# Altium schematic sheet MCU.SchDoc
size A3
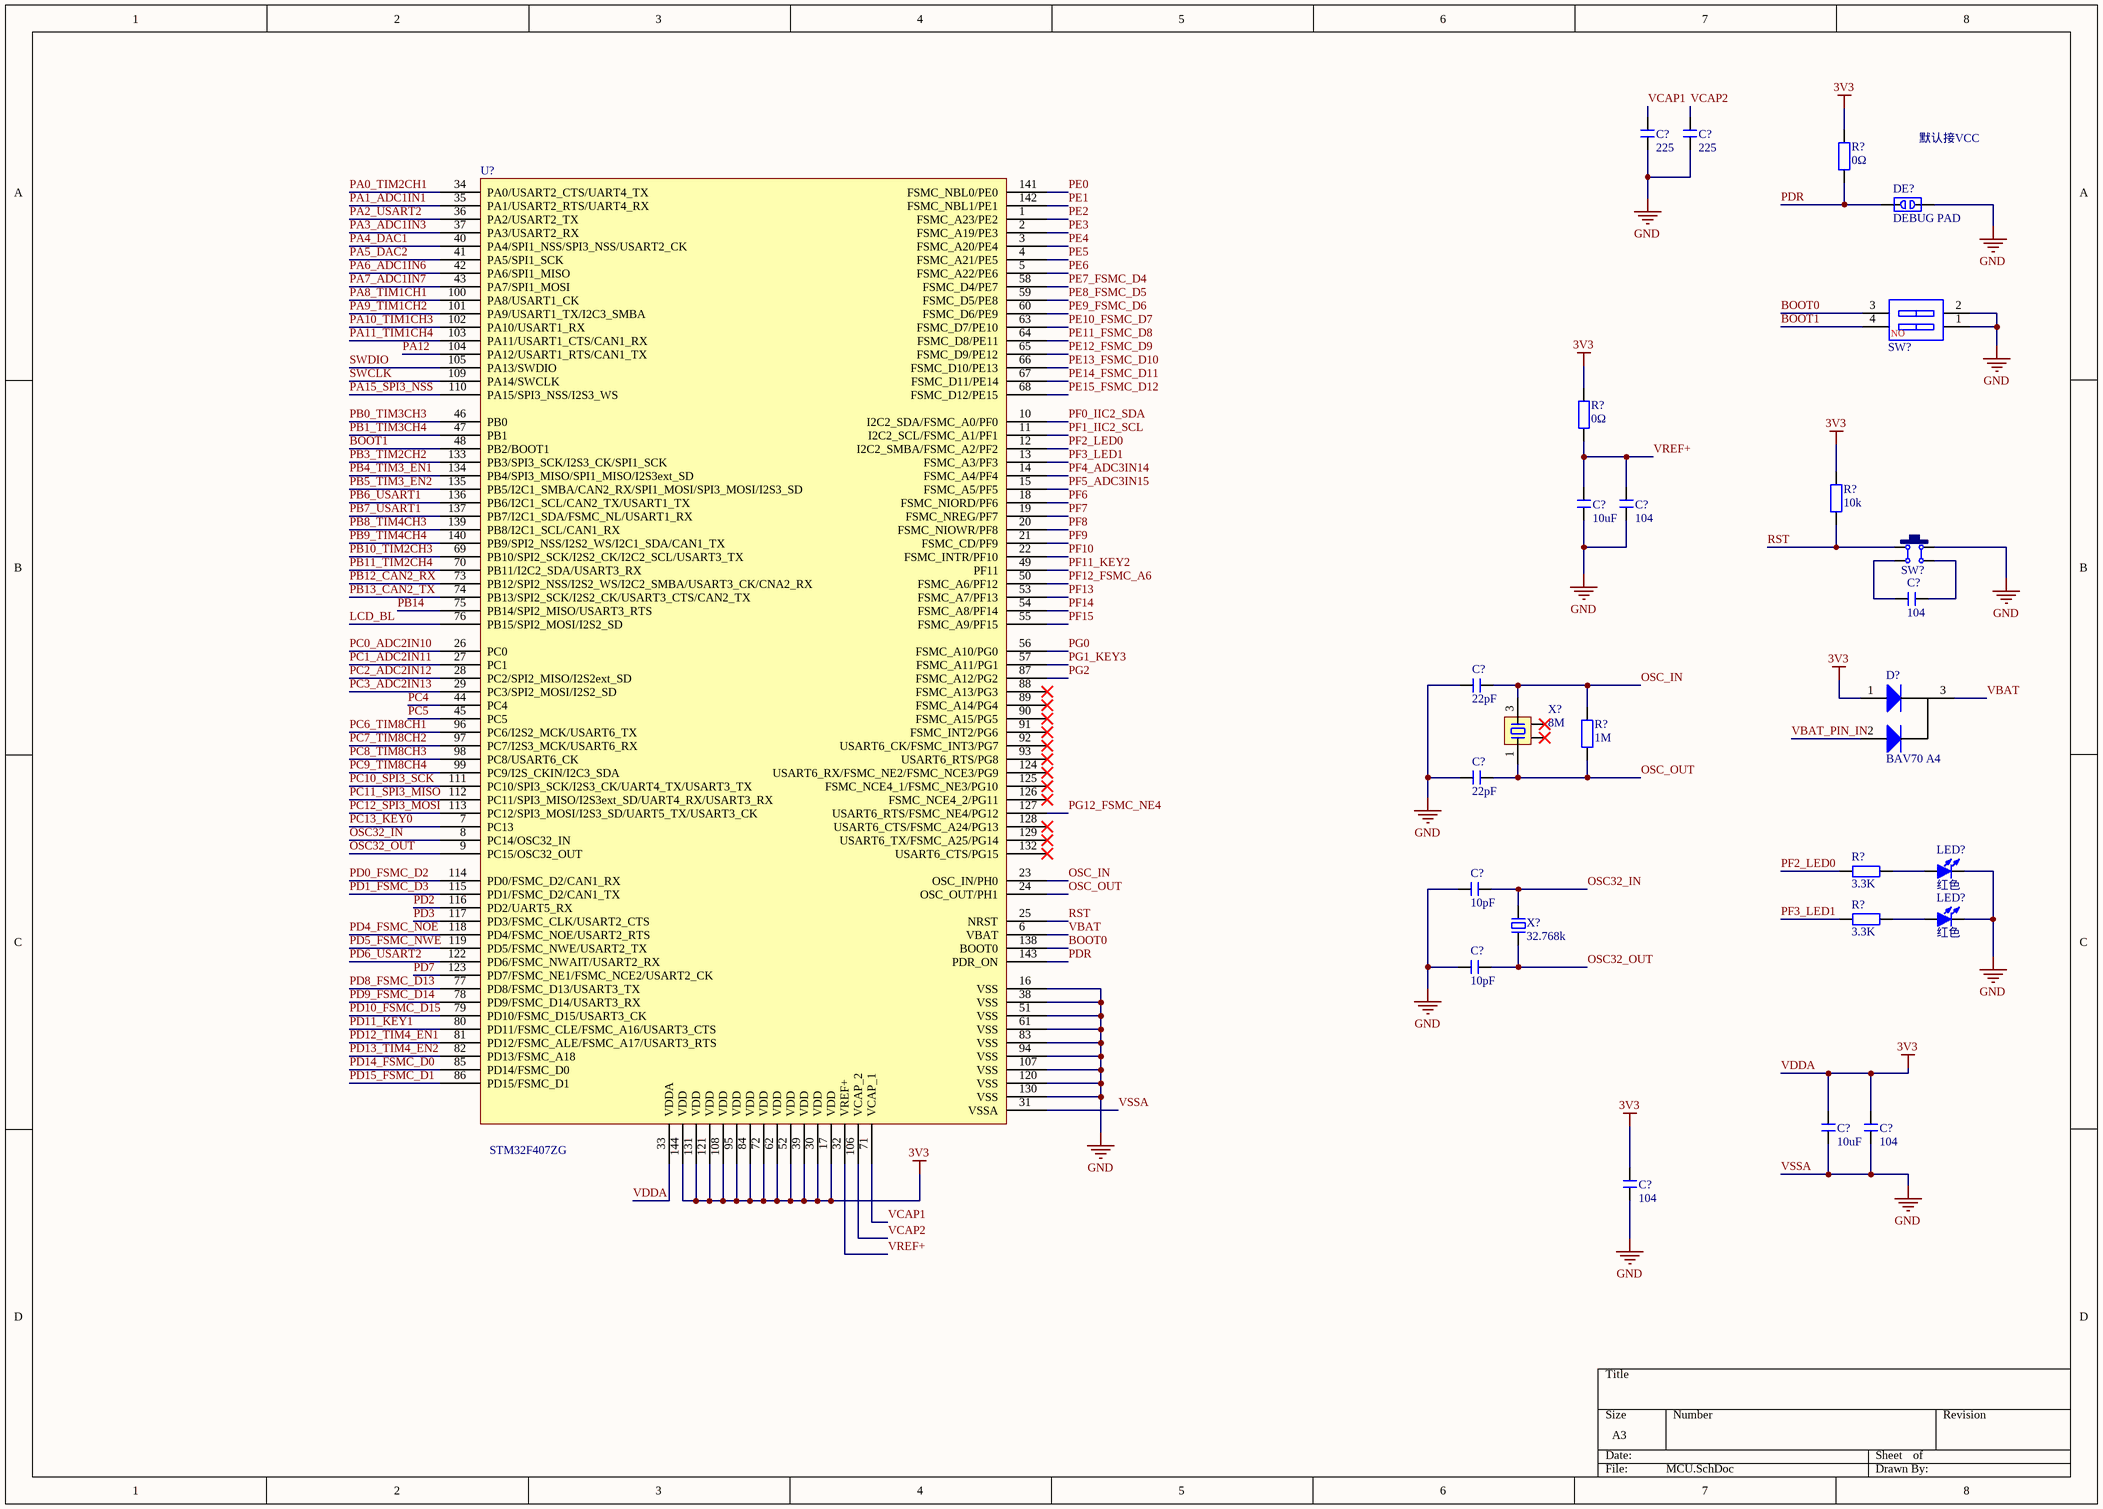
[diagram p0: MCU.SchDoc]

## Parts
(Parts that share a designator on the sheet are numbered #1, #2 ... from top to bottom, then left to right.)
C?#1  225  [C 0603_L]
C?#2  225  [C 0603_L]
C?#3  10uF  [C 0603_L]
C?#4  104  [C 0603_L]
C?#5  104  [C 0603_L]
C?#6  22pF  [C 0603_L]
C?#7  22pF  [C 0603_L]
C?#8  10pF  [C 0603_L]
C?#9  10pF  [C 0603_L]
C?#10  10uF  [C 0603_L]
C?#11  104  [C 0603_L]
C?#12  104  [C 0603_L]
D?  BAV70 A4  [SOT-23(SOT-23-3)]
DE?  DEBUG PAD  [DEBUG_A]
LED?#1  红色  [LED 0603R]
LED?#2  红色  [LED 0603B]
R?#1  0Ω  [R 0603_L]
R?#2  0Ω  [R 0603_L]
R?#3  10k  [R 0603_L]
R?#4  1M  [R 0603_L]
R?#5  3.3K  [R 0603_L]
R?#6  3.3K  [R 0603_L]
SW?#1  CSW-2P  [CSW DIP-2P]  (value not drawn)
SW?#2  6x6x5  [TSW SMD-6*6*4.3]  (value not drawn)
U?  STM32F407ZG  [LQFP144 20X20_L]
X?#1  8M  [OSC 1612-4P]
X?#2  32.768k  [OSC HC-49S]

## Nets
VDDA: C?#10.2 C?#11.2 C?#12.2 D?.1(A) R?#1.2 R?#2.2 R?#3.1 U?.17(VDD) U?.30(VDD) U?.33(VDDA) U?.39(VDD) U?.52(VDD) U?.62(VDD) U?.72(VDD) U?.84(VDD) U?.95(VDD) U?.108(VDD) U?.121(VDD) U?.131(VDD) U?.144(VDD)  [also labelled 3V3]
VSSA: C?#1.1 C?#2.1 C?#3.1 C?#4.1 C?#6.2 C?#7.2 C?#8.2 C?#9.2 C?#10.1 C?#11.1 C?#12.1 DE?.2 LED?#1.2(K) LED?#2.2(K) SW?#1.1 SW?#1.2 SW?#2.2 U?.16(VSS) U?.31(VSSA) U?.38(VSS) U?.51(VSS) U?.61(VSS) U?.83(VSS) U?.94(VSS) U?.107(VSS) U?.120(VSS) U?.130(VSS)  [also labelled GND]
BOOT0: SW?#1.3 U?.138(BOOT0)
BOOT1: SW?#1.4 U?.48(PB2/BOOT1)
LCD_BL: U?.76(PB15/SPI2_MOSI/I2S2_SD)
OSC32_IN: C?#8.1 U?.8(PC14/OSC32_IN) X?#2.2
OSC32_OUT: C?#9.1 U?.9(PC15/OSC32_OUT) X?#2.1
OSC_IN: C?#6.1 R?#4.1 U?.23(OSC_IN/PH0) X?#1.3
OSC_OUT: C?#7.1 R?#4.2 U?.24(OSC_OUT/PH1) X?#1.1
PA0_TIM2CH1: U?.34(PA0/USART2_CTS/UART4_TX)
PA1_ADC1IN1: U?.35(PA1/USART2_RTS/UART4_RX)
PA2_USART2: U?.36(PA2/USART2_TX)
PA3_ADC1IN3: U?.37(PA3/USART2_RX)
PA4_DAC1: U?.40(PA4/SPI1_NSS/SPI3_NSS/USART2_CK)
PA5_DAC2: U?.41(PA5/SPI1_SCK)
PA6_ADC1IN6: U?.42(PA6/SPI1_MISO)
PA7_ADC1IN7: U?.43(PA7/SPI1_MOSI)
PA8_TIM1CH1: U?.100(PA8/USART1_CK)
PA9_TIM1CH2: U?.101(PA9/USART1_TX/I2C3_SMBA)
PA10_TIM1CH3: U?.102(PA10/USART1_RX)
PA11_TIM1CH4: U?.103(PA11/USART1_CTS/CAN1_RX)
PA12: U?.104(PA12/USART1_RTS/CAN1_TX)
PA15_SPI3_NSS: U?.110(PA15/SPI3_NSS/I2S3_WS)
PB0_TIM3CH3: U?.46(PB0)
PB1_TIM3CH4: U?.47(PB1)
PB3_TIM2CH2: U?.133(PB3/SPI3_SCK/I2S3_CK/SPI1_SCK)
PB4_TIM3_EN1: U?.134(PB4/SPI3_MISO/SPI1_MISO/I2S3ext_SD)
PB5_TIM3_EN2: U?.135(PB5/I2C1_SMBA/CAN2_RX/SPI1_MOSI/SPI3_MOSI/I2S3_SD)
PB6_USART1: U?.136(PB6/I2C1_SCL/CAN2_TX/USART1_TX)
PB7_USART1: U?.137(PB7/I2C1_SDA/FSMC_NL/USART1_RX)
PB8_TIM4CH3: U?.139(PB8/I2C1_SCL/CAN1_RX)
PB9_TIM4CH4: U?.140(PB9/SPI2_NSS/I2S2_WS/I2C1_SDA/CAN1_TX)
PB10_TIM2CH3: U?.69(PB10/SPI2_SCK/I2S2_CK/I2C2_SCL/USART3_TX)
PB11_TIM2CH4: U?.70(PB11/I2C2_SDA/USART3_RX)
PB12_CAN2_RX: U?.73(PB12/SPI2_NSS/I2S2_WS/I2C2_SMBA/USART3_CK/CNA2_RX)
PB13_CAN2_TX: U?.74(PB13/SPI2_SCK/I2S2_CK/USART3_CTS/CAN2_TX)
PB14: U?.75(PB14/SPI2_MISO/USART3_RTS)
PC0_ADC2IN10: U?.26(PC0)
PC1_ADC2IN11: U?.27(PC1)
PC2_ADC2IN12: U?.28(PC2/SPI2_MISO/I2S2ext_SD)
PC3_ADC2IN13: U?.29(PC3/SPI2_MOSI/I2S2_SD)
PC4: U?.44(PC4)
PC5: U?.45(PC5)
PC6_TIM8CH1: U?.96(PC6/I2S2_MCK/USART6_TX)
PC7_TIM8CH2: U?.97(PC7/I2S3_MCK/USART6_RX)
PC8_TIM8CH3: U?.98(PC8/USART6_CK)
PC9_TIM8CH4: U?.99(PC9/I2S_CKIN/I2C3_SDA)
PC10_SPI3_SCK: U?.111(PC10/SPI3_SCK/I2S3_CK/UART4_TX/USART3_TX)
PC11_SPI3_MISO: U?.112(PC11/SPI3_MISO/I2S3ext_SD/UART4_RX/USART3_RX)
PC12_SPI3_MOSI: U?.113(PC12/SPI3_MOSI/I2S3_SD/UART5_TX/USART3_CK)
PC13_KEY0: U?.7(PC13)
PD0_FSMC_D2: U?.114(PD0/FSMC_D2/CAN1_RX)
PD1_FSMC_D3: U?.115(PD1/FSMC_D2/CAN1_TX)
PD2: U?.116(PD2/UART5_RX)
PD3: U?.117(PD3/FSMC_CLK/USART2_CTS)
PD4_FSMC_NOE: U?.118(PD4/FSMC_NOE/USART2_RTS)
PD5_FSMC_NWE: U?.119(PD5/FSMC_NWE/USART2_TX)
PD6_USART2: U?.122(PD6/FSMC_NWAIT/USART2_RX)
PD7: U?.123(PD7/FSMC_NE1/FSMC_NCE2/USART2_CK)
PD8_FSMC_D13: U?.77(PD8/FSMC_D13/USART3_TX)
PD9_FSMC_D14: U?.78(PD9/FSMC_D14/USART3_RX)
PD10_FSMC_D15: U?.79(PD10/FSMC_D15/USART3_CK)
PD11_KEY1: U?.80(PD11/FSMC_CLE/FSMC_A16/USART3_CTS)
PD12_TIM4_EN1: U?.81(PD12/FSMC_ALE/FSMC_A17/USART3_RTS)
PD13_TIM4_EN2: U?.82(PD13/FSMC_A18)
PD14_FSMC_D0: U?.85(PD14/FSMC_D0)
PD15_FSMC_D1: U?.86(PD15/FSMC_D1)
PDR: DE?.1 R?#1.1 U?.143(PDR_ON)
PE0: U?.141(FSMC_NBL0/PE0)
PE1: U?.142(FSMC_NBL1/PE1)
PE2: U?.1(FSMC_A23/PE2)
PE3: U?.2(FSMC_A19/PE3)
PE4: U?.3(FSMC_A20/PE4)
PE5: U?.4(FSMC_A21/PE5)
PE6: U?.5(FSMC_A22/PE6)
PE7_FSMC_D4: U?.58(FSMC_D4/PE7)
PE8_FSMC_D5: U?.59(FSMC_D5/PE8)
PE9_FSMC_D6: U?.60(FSMC_D6/PE9)
PE10_FSMC_D7: U?.63(FSMC_D7/PE10)
PE11_FSMC_D8: U?.64(FSMC_D8/PE11)
PE12_FSMC_D9: U?.65(FSMC_D9/PE12)
PE13_FSMC_D10: U?.66(FSMC_D10/PE13)
PE14_FSMC_D11: U?.67(FSMC_D11/PE14)
PE15_FSMC_D12: U?.68(FSMC_D12/PE15)
PF0_IIC2_SDA: U?.10(I2C2_SDA/FSMC_A0/PF0)
PF1_IIC2_SCL: U?.11(I2C2_SCL/FSMC_A1/PF1)
PF2_LED0: R?#5.1 U?.12(I2C2_SMBA/FSMC_A2/PF2)
PF3_LED1: R?#6.1 U?.13(FSMC_A3/PF3)
PF4_ADC3IN14: U?.14(FSMC_A4/PF4)
PF5_ADC3IN15: U?.15(FSMC_A5/PF5)
PF6: U?.18(FSMC_NIORD/PF6)
PF7: U?.19(FSMC_NREG/PF7)
PF8: U?.20(FSMC_NIOWR/PF8)
PF9: U?.21(FSMC_CD/PF9)
PF10: U?.22(FSMC_INTR/PF10)
PF11_KEY2: U?.49(PF11)
PF12_FSMC_A6: U?.50(FSMC_A6/PF12)
PF13: U?.53(FSMC_A7/PF13)
PF14: U?.54(FSMC_A8/PF14)
PF15: U?.55(FSMC_A9/PF15)
PG0: U?.56(FSMC_A10/PG0)
PG1_KEY3: U?.57(FSMC_A11/PG1)
PG2: U?.87(FSMC_A12/PG2)
PG12_FSMC_NE4: U?.127(USART6_RTS/FSMC_NE4/PG12)
RST: R?#3.2 SW?#2.1 U?.25(NRST)
SWCLK: U?.109(PA14/SWCLK)
SWDIO: U?.105(PA13/SWDIO)
VBAT: D?.3(K) U?.6(VBAT)
VBAT_PIN_IN: D?.2(A)
VCAP1: C?#1.2 U?.71(VCAP_1)
VCAP2: C?#2.2 U?.106(VCAP_2)
VREF+: C?#3.2 C?#4.2 R?#2.1 U?.32(VREF+)
NetC?#5_1: C?#5.1 SW?#2.4
NetC?#5_2: C?#5.2 SW?#2.3
NetLED?#1_1: LED?#1.1(A) R?#5.2
NetLED?#2_1: LED?#2.1(A) R?#6.2

Not connected (* = marked no-connect by the designer): U? 88(FSMC_A13/PG3)* 89(FSMC_A14/PG4)* 90(FSMC_A15/PG5)* 91(FSMC_INT2/PG6)* 92(USART6_CK/FSMC_INT3/PG7)* 93(USART6_RTS/PG8)* 124(USART6_RX/FSMC_NE2/FSMC_NCE3/PG9)* 125(FSMC_NCE4_1/FSMC_NE3/PG10)* 126(FSMC_NCE4_2/PG11)* 128(USART6_CTS/FSMC_A24/PG13)* 129(USART6_TX/FSMC_A25/PG14)* 132(USART6_CTS/PG15)*; X?#1 2* 4*

## Notes on the sheet
- 默认接VCC
- (in symbol CSW-2P) NO

## Library data of the parts
C?#1-C?#12 = C: 无极性贴片电容; 版权归属: 源创客; BOM名称: 无极性贴片电容; 学习资源: www.ooocke.com
D? = SOT-23 BAV70 A4: 开关二极管; ComponentLink1Description: 供应商链接; ComponentLink1URL: http://www.szlcsc.com/product/details_70091.html; Package: SOT-23; Supplier: LC; SuppliersPartNumber: C68978
DE? = DEBUG: 调试断点焊盘; 版权归属: 源创客; BOM名称: 调试断点焊盘; 学习资源: www.ooocke.com
LED?#1 LED?#2 = LED-SMD: 贴片LED; 版权归属: 源创客; BOM名称: 贴片LED; 学习资源: www.ooocke.com
R?#1-R?#6 = R: 贴片电阻; 版权归属: 源创客; BOM名称: 贴片电阻; 学习资源: www.ooocke.com
SW?#1 = CSW-2P: 2路编码开关; 版权归属: 源创客; BOM名称: 2路编码开关; 学习资源: www.ooocke.com
SW?#2 = TSW SMD-6x6: 贴片6x6轻触开关; 版权归属: 源创客; BOM名称: 贴片6x6轻触开关; 学习资源: www.ooocke.com
U? = STM32F407ZG: Flaah:1024/RAM:192/IO:114; BOM名称: 32位ST单片机; 版权归属: 源创客; 学习资源: www.ooocke.com
X?#1 = XTAL-4P: 4脚无源晶振; 版权归属: 源创客; BOM名称: 4脚无源晶振; 学习资源: www.ooocke.com
X?#2 = XTAL-2P: 2脚无源脚晶振; 版权归属: 源创客; BOM名称: 2脚无源脚晶振; 学习资源: www.ooocke.com